# EAGLE design untitled (EAGLE 9.6.2)
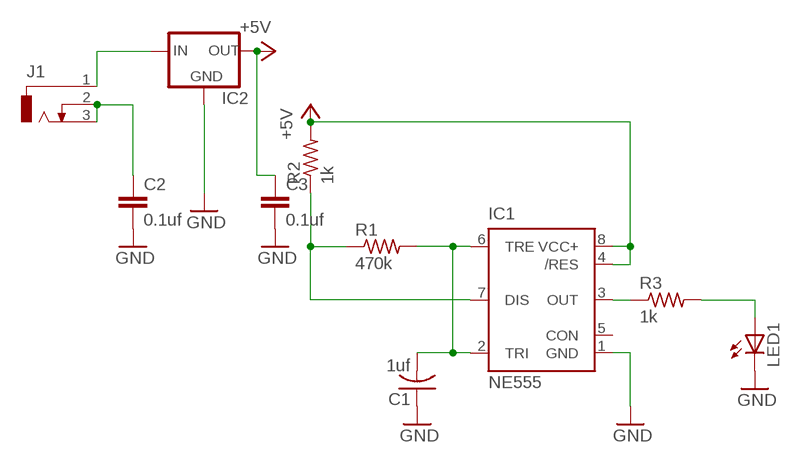
[diagram p0: schematic, sheet 1]

## Parts
C1  1uf  C-US025-024X044  [C025-024X044]
C2  0.1uf  C-EU025-030X050  [C025-030X050]
C3  0.1uf  C-EU025-030X050  [C025-030X050]
IC1  NE555  [DIL-08]
IC2  78XXS  [78XXS]
J1  DCJ0303  [DCJ0303]
LED1  LED5MM  [LED5MM]
R1  470k  R-US_0309/12  [0309/12]
R2  1k  R-US_0309/12  [0309/12]
R3  1k  R-US_0309/12  [0309/12]

## Nets
+5V: C3.1 IC1.4(/RES) IC1.8(VCC+) IC2.OUT R2.2
GND: C1.1 C2.2 C3.2 IC1.1(GND) IC2.GND LED1.K(C)
N$1: C1.2 IC1.2(TRI) IC1.6(TRE) R1.2
N$2: IC1.7(DIS) R1.1 R2.1
N$3: IC1.3(OUT) R3.1
N$4: LED1.A R3.2
N$6: C2.1 J1.2 J1.3
N$7: IC2.IN J1.1
Unconnected: IC1.5(CON)

## Library data of the parts
C1 = rcl:C-US: CAPACITOR, American symbol; SPICEPREFIX: C
C2 C3 = rcl:C-EU: CAPACITOR, European symbol; SPICEPREFIX: C
IC1 = st-microelectronics:NE555: General purpose bipolar Timer; MF: Arrow Electronics; MPN: NE555N; OC_FARNELL: 1467742; OC_NEWARK: 89K1486
IC2 = v-reg:78XXS: VOLTAGE REGULATOR
J1 = con-jack:DCJ0303: DC POWER JACK Source: DCJ0303.pdf; OC_FARNELL: unknown; OC_NEWARK: unknown
LED1 = adafruit:LED: LED OSRAM: - CHIPLED LG R971, LG N971, LY N971, LG Q971, LY Q971, LO R971, LY R971 LH N974, LH R974 LS Q976, LO Q976, LY Q976 LO Q996 - Hyper CHIPLED LW Q18S LB Q993, LB Q99A, LB R99A - SideLED LS A670, LO A670, LY A670, LG A670, LP A670 LB A673, LV A673, LT A673, LW A673 LH A674 LY A675 LS A676, LA A676, LO A676, LY A676, LW A676 LS A679, LY A679, LG A679 - Hyper Micro SIDELED® LS Y876, LA Y876, LO Y876, LY Y876 LT Y87S - SmartLED LW L88C, LW L88S LB L89C, LB L89S, LG L890 LS L89K, LO L89K, LY L89K LS L896, LA L896, LO L896, LY L896 - TOPLED LS T670, LO T670, LY T670, LG T670, LP T670 LSG T670, LSP T670, LSY T670, LOP T670, LYG T670 LG T671, LOG T671, LSG T671 LB T673, LV T673, LT T673, LW T673 LH T674 LS T676, LA T676, LO T676, LY T676, LB T676, LH T676, LSB T676, LW T676 LB T67C, LV T67C, LT T67C, LS T67K, LO T67K, LY T67K, LW E67C LS E67B, LA E67B, LO E67B, LY E67B, LB E67C, LV E67C, LT E67C LW T67C LS T679, LY T679, LG T679 LS T770, LO T770, LY T770, LG T770, LP T770 LB T773, LV T773, LT T773, LW T773 LH T774 LS E675, LA E675, LY E675, LS T675 LS T776, LA T776, LO T776, LY T776, LB T776 LHGB T686 LT T68C, LB T68C - Hyper Mini TOPLED® LB M676 - Mini TOPLED Santana® LG M470 LS M47K, LO M47K, LY M47K Source: http://www.osram.convergy.de/
R1-R3 = rcl:R-US_: RESISTOR, American symbol; SPICEPREFIX: R

## Board
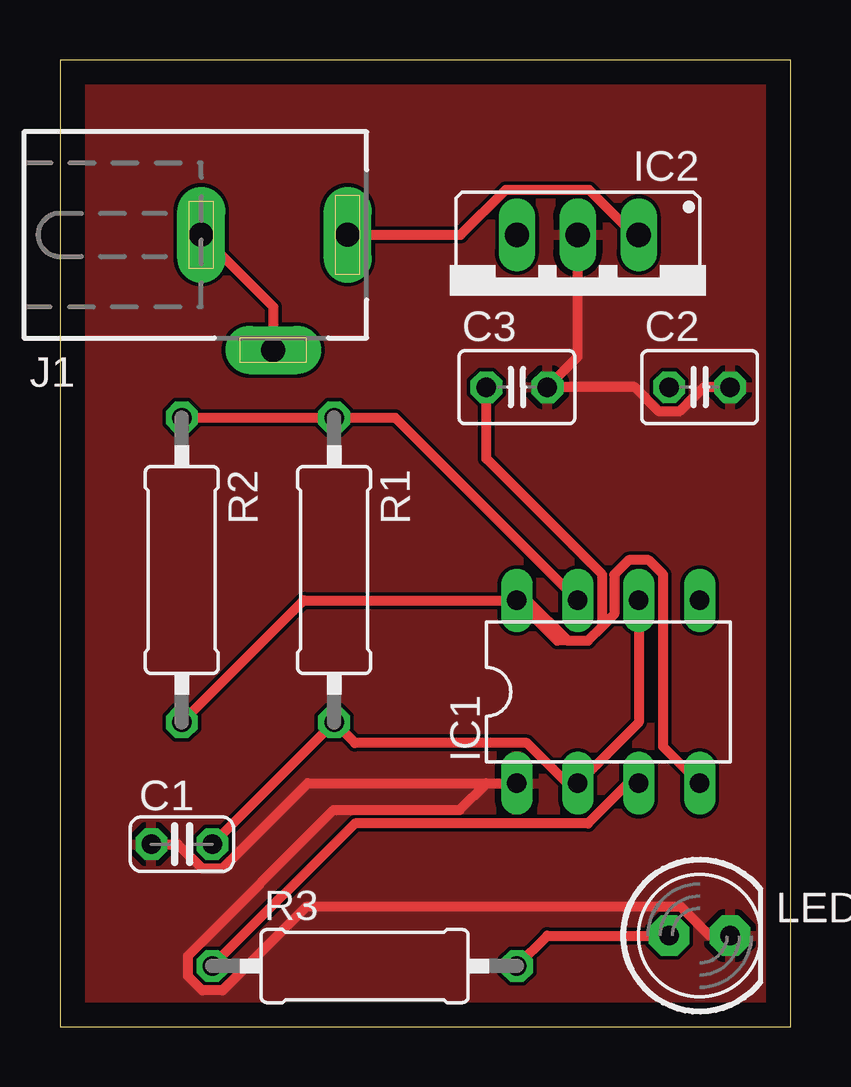
[diagram p1: board, top side]
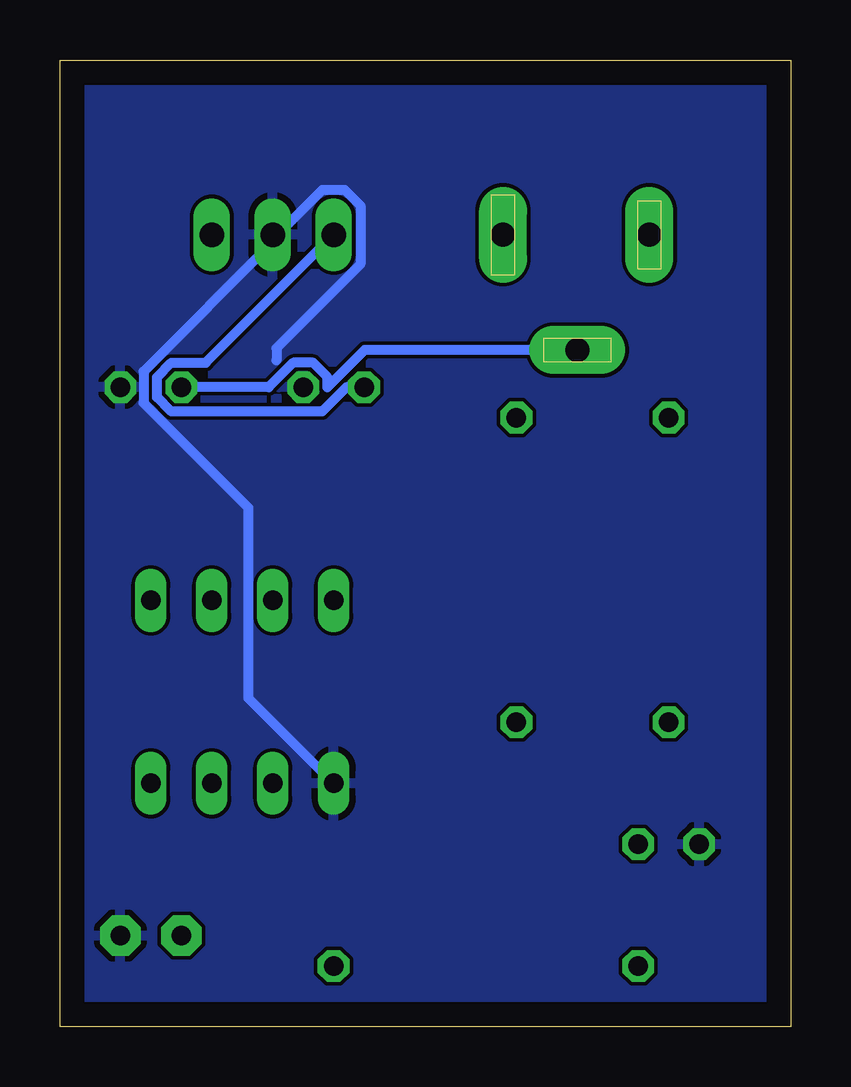
[diagram p2: board, bottom side, seen from below]

Size 30.46 x 40.31 mm. Coordinates in mm from the lower left corner, seen from the top.
Outline: 0,0 30.46,0 30.46,40.31 0,40.31 0,0
Copper layers (1*16): Top 0.035mm / dielectric 1.5mm / Bottom 0.035mm
Design rules "default": minimum track width 6mil, minimum drill 0.35mm, track to track 6mil, track to pad 6mil, pad to pad 6mil, via to via 6mil, smd to smd 6mil, copper to edge 40mil, drill to drill 6mil, minimum pad ring 10mil, minimum via ring 8mil, stop-mask expansion 4mil, vias tented up to drill 0mil, thermal gap 10mil

### Footprints (pad centres in the part's own frame; a part is rotated, then mirrored left to right if it is on the bottom)
C025-024X044 = drill 0.813 octagon: 1 -1.27,0; 2 1.27,0
C025-030X050 = drill 0.813 octagon: 1 -1.27,0; 2 1.27,0
DIL-08 = drill 0.813 long: 1 -3.81,-3.81; 2 -1.27,-3.81; 3 1.27,-3.81; 4 3.81,-3.81; 5 3.81,3.81; 6 1.27,3.81; 7 -1.27,3.81; 8 -3.81,3.81
78XXS = drill 1.016 long: GND 0,-2.54; IN -2.54,-2.54; OUT 2.54,-2.54
DCJ0303 = drill 1 pad 2 long: 1 0,3.1; 2 4.8,0; 3 0,-3
LED5MM = drill 0.813 pad 1.676 octagon: A -1.27,0; K 1.27,0
0309/12 = drill 0.813 octagon: 1 -6.35,0; 2 6.35,0

### Placement (x,y rotation side)
C1  5.08,7.62 0 top
C2  26.67,26.67 0 top
C3  19.05,26.67 0 top
IC1  22.86,13.97 0 top
IC2  21.59,30.48 180 top
J1  8.89,33.02 270 top
LED1  26.67,3.81 0 top
R1  11.43,19.05 270 top
R2  5.08,19.05 270 top
R3  12.7,2.54 0 top

### Tracks (layer width: path | path; a pad name or v marks a point on that pad's centre or on a via)
+5V
  Top 0.406: 21.17,16.1 22.01,16.1 22.61,16.7 | 22.61,16.7 22.61,18.86 17.78,23.69 C3.1 | IC1.8 19.49,17.78 21.17,16.1 | IC1.4 25.15,11.68 25.15,18.86 24.55,19.46 23.71,19.46 23.11,18.86 23.11,17.21 22.61,16.7 | 21.17,16.1 20.73,16.1 IC1.8 | R2.2 10.16,17.78 IC1.8
  Bottom 0.406: C3.1 18.51,26.67 19.53,25.65 25.82,25.65 26.42,26.25 26.42,27.09 25.82,27.69 24.38,27.69 IC2.OUT
GND
  Top 0.406: LED1.K 27.09,3.81 25.89,5 10.25,5 6.77,1.52 5.93,1.52 5.33,2.12 5.33,2.96 11.42,9.04 16.66,9.04 17.78,10.16 IC1.1 10.33,10.16 6.77,6.6 5.93,6.6 4.91,7.62 C1.1 | C2.2 26.84,26.67 25.82,25.65 24.98,25.65 23.96,26.67 C3.2 21.59,27.94 IC2.GND
  Bottom 0.406: IC1.1 22.61,13.72 22.61,21.65 26.97,26.02 26.97,27.32 21.59,32.71 IC2.GND 21.39,33.02 19.51,34.9 18.59,34.9 17.93,34.25 17.93,31.8 21.43,28.29 21.43,27.78
  pour Bottom: 0,40.64 30.48,40.64 30.48,0 0,0
  pour Top: 0,40.64 30.48,40.64 30.48,0 0,0
N$1
  Top 0.406: IC1.6 24.13,12.7 IC1.2 21.15,10.16 19.47,11.84 12.29,11.84 R1.2 C1.2
N$2
  Top 0.406: R2.1 R1.1 13.97,25.4 IC1.7
N$3
  Top 0.406: IC1.3 23.69,10.16 22.01,8.48 12.29,8.48 R3.1
N$4
  Top 0.406: R3.2 20.32,3.81 LED1.A
N$6
  Top 0.406: J1.3 8.89,30.02 J1.2
  Bottom 0.406: J1.2 17.75,28.22 19.3,26.67 19.3,27.09 19.9,27.69 20.74,27.69 21.76,26.67 C2.1
N$7
  Top 0.406: J1.1 16.71,33.02 18.59,34.9 22.05,34.9 23.93,33.02 IC2.IN